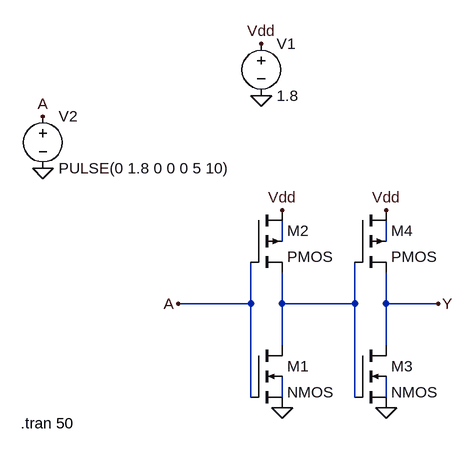
[diagram p0: schematic BUF.asc]
BUF.asc, the LTspice schematic file:
Version 4
SHEET 1 880 680
WIRE 448 224 448 192
WIRE 608 224 608 192
WIRE 400 320 400 256
WIRE 400 320 288 320
WIRE 448 320 448 272
WIRE 560 320 560 256
WIRE 560 320 448 320
WIRE 608 320 608 272
WIRE 688 320 608 320
WIRE 448 384 448 320
WIRE 608 384 608 320
WIRE 400 464 400 320
WIRE 448 464 448 432
WIRE 560 464 560 320
WIRE 608 464 608 432
FLAG 288 320 A
FLAG 416 -80 Vdd
FLAG 448 480 0
FLAG 416 0 0
FLAG 448 176 Vdd
FLAG 80 32 A
FLAG 80 112 0
FLAG 608 480 0
FLAG 608 176 Vdd
FLAG 688 320 Y
SYMBOL voltage 416 -96 R0
WINDOW 123 0 0 Left 0
WINDOW 39 0 0 Left 0
SYMATTR InstName V1
SYMATTR Value 1.8
SYMBOL voltage 80 16 R0
WINDOW 123 0 0 Left 0
WINDOW 39 0 0 Left 0
SYMATTR InstName V2
SYMATTR Value PULSE(0 1.8 0 0 0 5 10)
SYMBOL nmos4 400 384 R0
SYMATTR InstName M1
SYMATTR Value2 l=0.13u w=0.13u
SYMBOL pmos4 400 176 R0
SYMATTR InstName M2
SYMATTR Value2 l=0.13u w=0.13u
SYMBOL nmos4 560 384 R0
SYMATTR InstName M3
SYMATTR Value2 l=0.13u w=0.13u
SYMBOL pmos4 560 176 R0
SYMATTR InstName M4
SYMATTR Value2 l=0.13u w=0.13u
TEXT 46 504 Left 2 !.tran 50

The netlist it stands for:
* BUF.asc
V1 Vdd 0 1.8
V2 A 0 PULSE(0 1.8 0 0 0 5 10)
M1 N003 A 0 N004 NMOS l=0.13u w=0.13u
M2 Vdd A N003 N001 PMOS l=0.13u w=0.13u
M3 Y N003 0 N005 NMOS l=0.13u w=0.13u
M4 Vdd N003 Y N002 PMOS l=0.13u w=0.13u
.model NMOS NMOS
.model PMOS PMOS
.lib standard.mos
.tran 50
.backanno
.end